# EAGLE schematic PCB-CMB-5-SHLD-3x5-1208 (EAGLE 6.5.0)

## Sheet 1 of 2
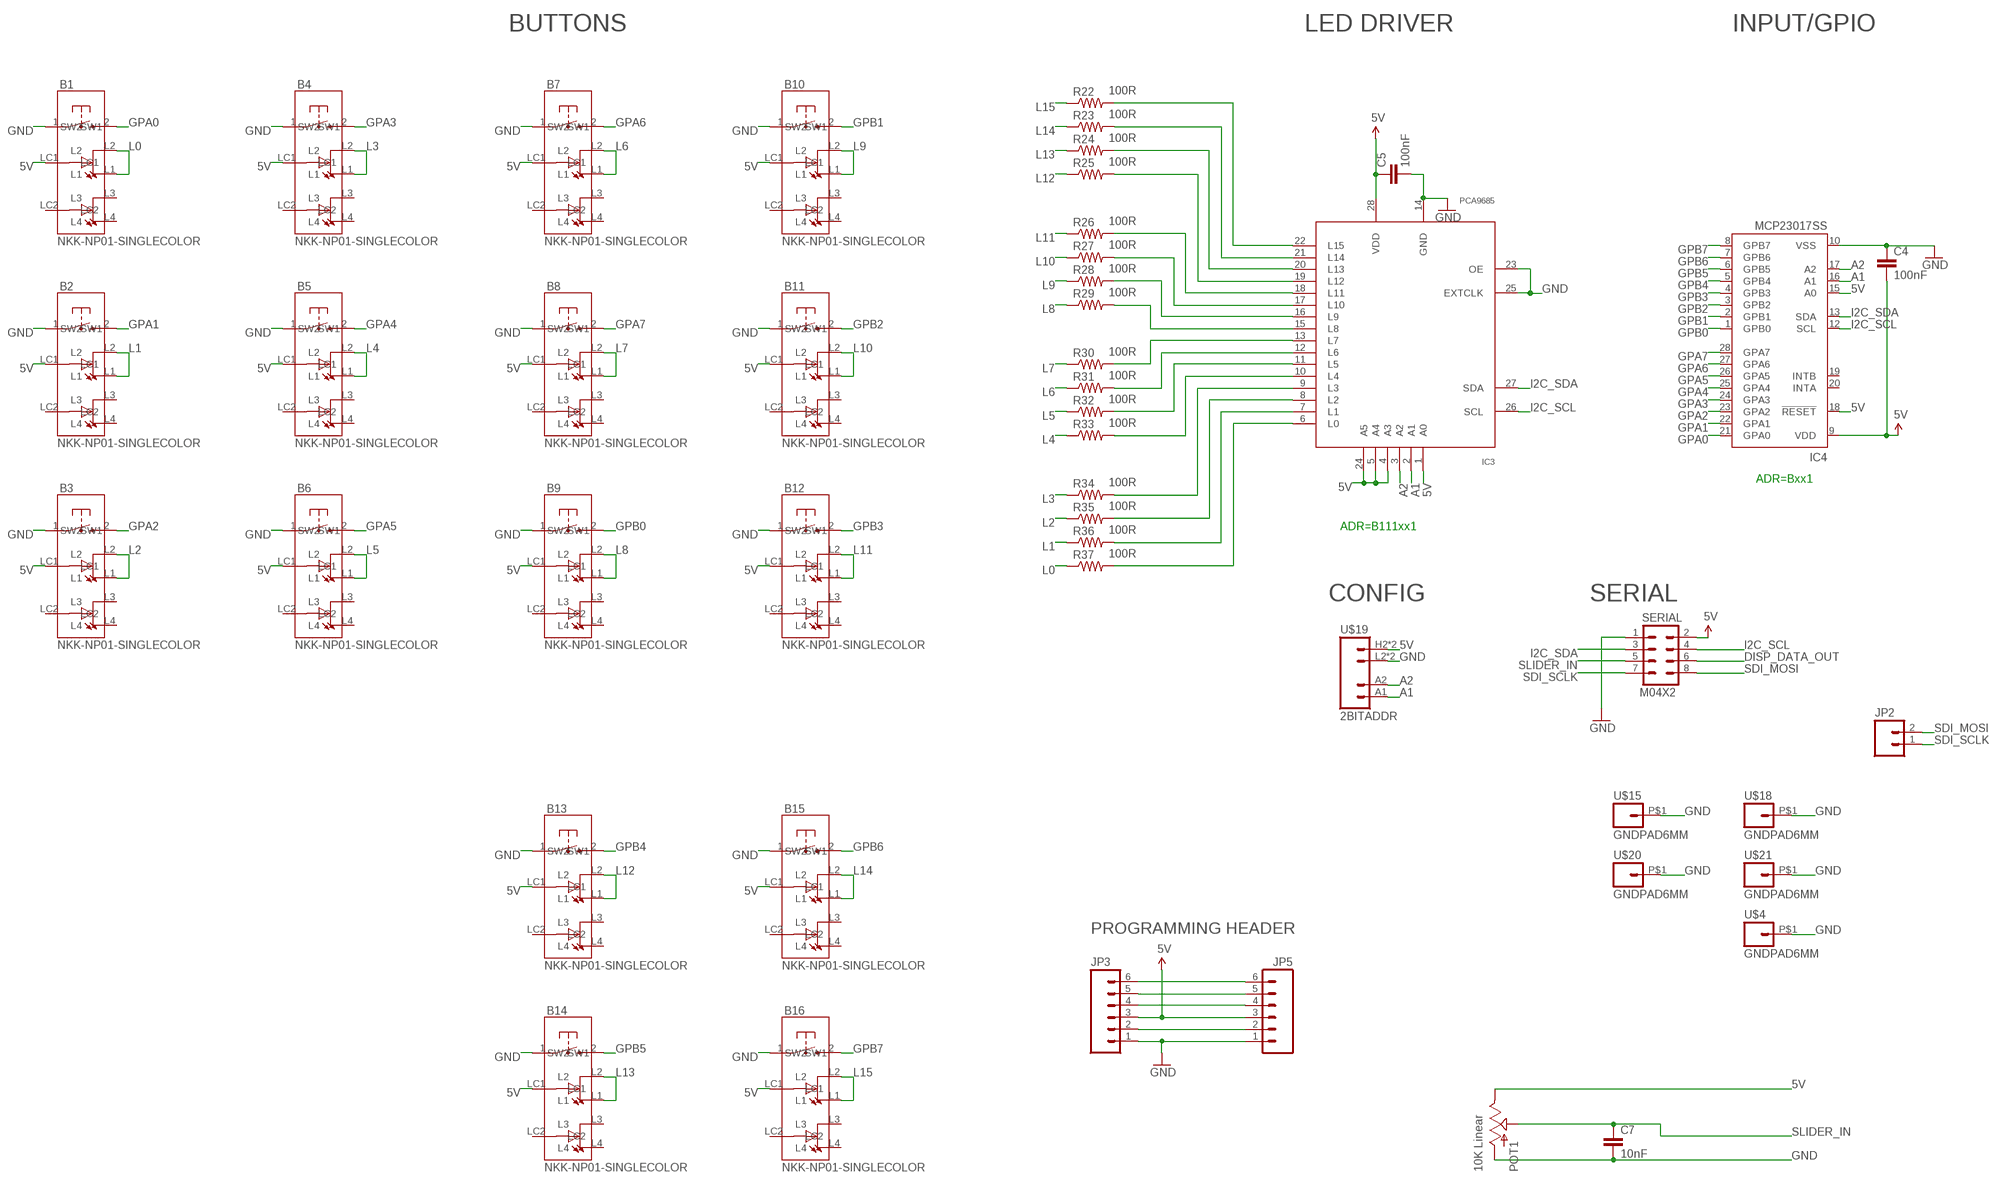
[diagram p0: schematic, sheet 1, part 1 of 2]
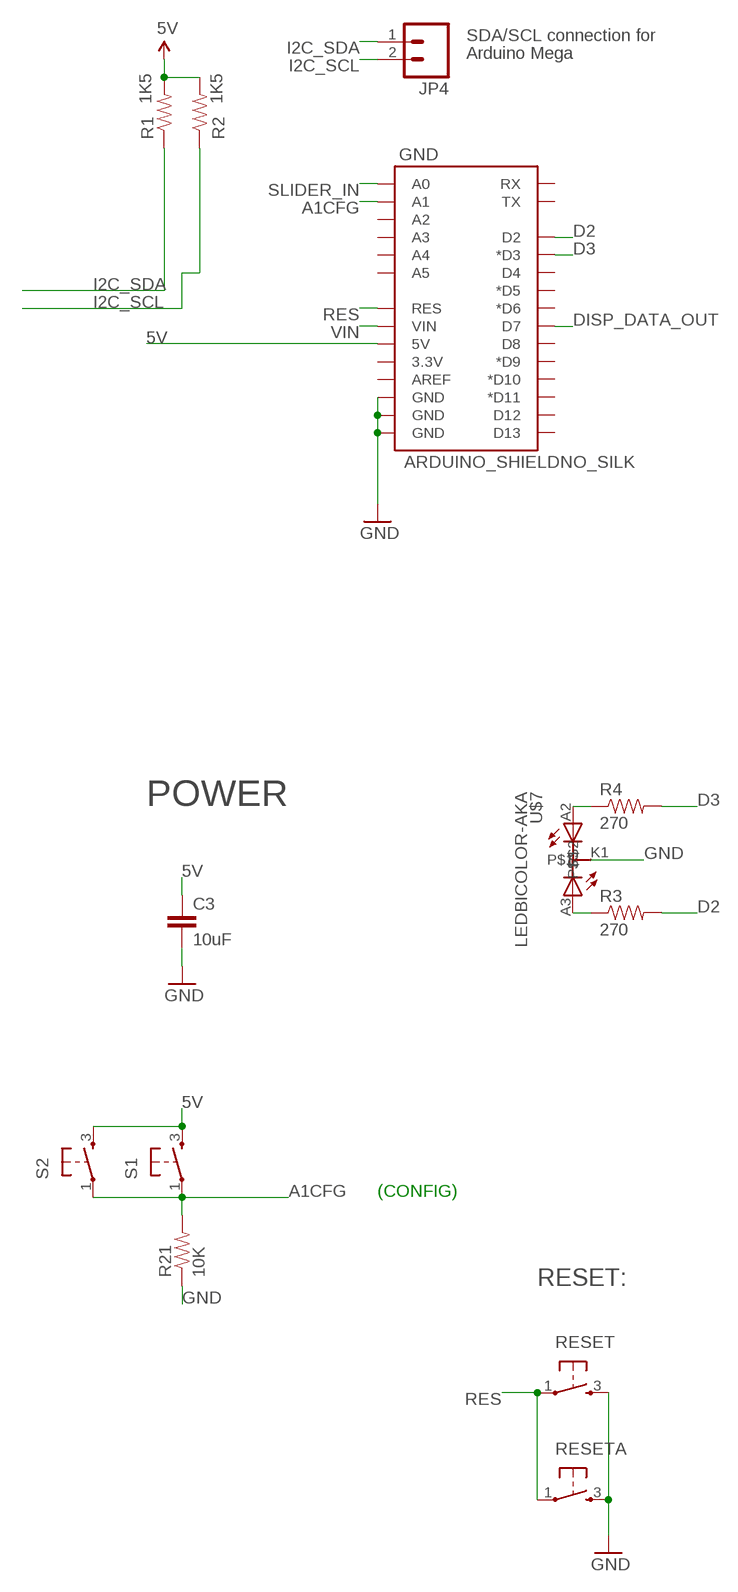
[diagram p1: schematic, sheet 1, part 2 of 2]

### Parts
B1  NKK-NP01-SINGLECOLOR  [NKK-NP01]
B2  NKK-NP01-SINGLECOLOR  [NKK-NP01]
B3  NKK-NP01-SINGLECOLOR  [NKK-NP01]
B4  NKK-NP01-SINGLECOLOR  [NKK-NP01]
B5  NKK-NP01-SINGLECOLOR  [NKK-NP01]
B6  NKK-NP01-SINGLECOLOR  [NKK-NP01]
B7  NKK-NP01-SINGLECOLOR  [NKK-NP01]
B8  NKK-NP01-SINGLECOLOR  [NKK-NP01]
B9  NKK-NP01-SINGLECOLOR  [NKK-NP01]
B10  NKK-NP01-SINGLECOLOR  [NKK-NP01]
B11  NKK-NP01-SINGLECOLOR  [NKK-NP01]
B12  NKK-NP01-SINGLECOLOR  [NKK-NP01]
B13  NKK-NP01-SINGLECOLOR  [NKK-NP01]
B14  NKK-NP01-SINGLECOLOR  [NKK-NP01]
B15  NKK-NP01-SINGLECOLOR  [NKK-NP01]
B16  NKK-NP01-SINGLECOLOR  [NKK-NP01]
C3  10uF  CAP0805  [0805]
C4  100nF  CAP0603-CAP  [0603-CAP]
C5  100nF  CAP0603-CAP  [0603-CAP]
C7  10nF  CAP0603-CAP  [0603-CAP]
GND  ARDUINO_SHIELDNO_SILK  [DUEMILANOVE_VIAS]
IC3  PCA9685  [TSSOP28]
IC4  MCP23017SS  [SSOP28]
JP2  M02PTH  [1X02]
JP3  M06POLAR  [MOLEX-1X6]
JP4  M02PTH  [1X02]
JP5  M06POLAR  [MOLEX-1X6]
POT1  10K Linear  SLIDER20  [SLIDER20]
R1  1K5  RESISTOR0603-RES  [0603-RES]
R2  1K5  RESISTOR0603-RES  [0603-RES]
R3  270  RESISTOR0603-RES  [0603-RES]
R4  270  RESISTOR0603-RES  [0603-RES]
R21  10K  RESISTOR0603-RES  [0603-RES]
R22  100R  RESISTOR1206  [1206]
R23  100R  RESISTOR1206  [1206]
R24  100R  RESISTOR1206  [1206]
R25  100R  RESISTOR1206  [1206]
R26  100R  RESISTOR1206  [1206]
R27  100R  RESISTOR1206  [1206]
R28  100R  RESISTOR1206  [1206]
R29  100R  RESISTOR1206  [1206]
R30  100R  RESISTOR1206  [1206]
R31  100R  RESISTOR1206  [1206]
R32  100R  RESISTOR1206  [1206]
R33  100R  RESISTOR1206  [1206]
R34  100R  RESISTOR1206  [1206]
R35  100R  RESISTOR1206  [1206]
R36  100R  RESISTOR1206  [1206]
R37  100R  RESISTOR1206  [1206]
RESET  TAC_SWITCH  [PUSHBUTTON]
RESETA  TAC_SWITCH  [PUSHBUTTON]
S1  TAC_SWITCH  [PUSHBUTTON]
S2  TAC_SWITCH  [PUSHBUTTON]
SERIAL  M04X2  [2X4]
U$4  GNDPAD6MM  [3.2MMPAD6MM]
U$7  LEDBICOLOR-AKA  [LED5MM-BICOLOR]
U$15  GNDPAD6MM  [3.2MMPAD6MM]
U$18  GNDPAD6MM  [3.2MMPAD6MM]
U$19  2BITADDR  [2BITADDR]
U$20  GNDPAD6MM  [3.2MMPAD6MM]
U$21  GNDPAD6MM  [3.2MMPAD6MM]

### Nets
5V [PWR]: B1.LC1 B2.LC1 B3.LC1 B4.LC1 B5.LC1 B6.LC1 B7.LC1 B8.LC1 B9.LC1 B10.LC1 B11.LC1 B12.LC1 B13.LC1 B14.LC1 B15.LC1 B16.LC1 C3.1 C4.2 C5.1 GND.5V IC3.1(A0) IC3.4(A3) IC3.5(A4) IC3.24(A5) IC3.28(VDD) IC4.9(VDD) IC4.15(A0) IC4.18(!RESET) JP3.3 JP5.3 POT1.1(E) R1.2 R2.2 S1.3 S2.3 SERIAL.2 U$19.H2(VCC) U$19.H3(VCC)
A1: IC3.2(A1) IC4.16(A1) U$19.A1
A1CFG: GND.A1 R21.2 S1.1 S2.1
A2: IC3.3(A2) IC4.17(A2) U$19.A2
D2: GND.D2 R3.2
D3: GND.D3(*D3) R4.2
DISP_DATA_OUT: GND.D7 SERIAL.6
GND [PWR]: B1.1(SW1) B2.1(SW1) B3.1(SW1) B4.1(SW1) B5.1(SW1) B6.1(SW1) B7.1(SW1) B8.1(SW1) B9.1(SW1) B10.1(SW1) B11.1(SW1) B12.1(SW1) B13.1(SW1) B14.1(SW1) B15.1(SW1) B16.1(SW1) C3.2 C4.1 C5.2 C7.2 GND.GND@0(GND) GND.GND@1(GND) GND.GND@2(GND) IC3.14(GND) IC3.23(OE) IC3.25(EXTCLK) IC4.10(VSS) JP3.1 JP5.1 POT1.3(A) R21.1 RESET.3 RESETA.3 SERIAL.1 U$4.P$1 U$7.K1 U$15.P$1 U$18.P$1 U$19.L2(GND) U$19.L3(GND) U$20.P$1 U$21.P$1
GPA0: B1.2(SW2) IC4.21(GPA0)
GPA1: B2.2(SW2) IC4.22(GPA1)
GPA2: B3.2(SW2) IC4.23(GPA2)
GPA3: B4.2(SW2) IC4.24(GPA3)
GPA4: B5.2(SW2) IC4.25(GPA4)
GPA5: B6.2(SW2) IC4.26(GPA5)
GPA6: B7.2(SW2) IC4.27(GPA6)
GPA7: B8.2(SW2) IC4.28(GPA7)
GPB0 [PWR]: B9.2(SW2) IC4.1(GPB0)
GPB1: B10.2(SW2) IC4.2(GPB1)
GPB2: B11.2(SW2) IC4.3(GPB2)
GPB3: B12.2(SW2) IC4.4(GPB3)
GPB4: B13.2(SW2) IC4.5(GPB4)
GPB5: B14.2(SW2) IC4.6(GPB5)
GPB6: B15.2(SW2) IC4.7(GPB6)
GPB7: B16.2(SW2) IC4.8(GPB7)
I2C_SCL: IC3.26(SCL) IC4.12(SCL) JP4.2 R2.1 SERIAL.4
I2C_SDA: IC3.27(SDA) IC4.13(SDA) JP4.1 R1.1 SERIAL.3
L0: B1.L1 B1.L2 R37.1
L1: B2.L1 B2.L2 R36.1
L2: B3.L1 B3.L2 R35.1
L3: B4.L1 B4.L2 R34.1
L4: B5.L1 B5.L2 R33.1
L5: B6.L1 B6.L2 R32.1
L6: B7.L1 B7.L2 R31.1
L7: B8.L1 B8.L2 R30.1
L8: B9.L1 B9.L2 R29.1
L9: B10.L1 B10.L2 R28.1
L10: B11.L1 B11.L2 R27.1
L11: B12.L1 B12.L2 R26.1
L12: B13.L1 B13.L2 R25.1
L13: B14.L1 B14.L2 R24.1
L14: B15.L1 B15.L2 R23.1
L15: B16.L1 B16.L2 R22.1
N$2: IC3.13(L7) R30.2
N$3: JP3.4 JP5.4
N$7: R4.1 U$7.A2
N$8: JP3.5 JP5.5
N$11: R3.1 U$7.A3
N$12: JP3.2 JP5.2
N$19: IC3.12(L6) R31.2
N$23: IC3.11(L5) R32.2
N$31: IC3.10(L4) R33.2
N$45: JP3.6 JP5.6
N$58: IC3.9(L3) R34.2
N$59: IC3.8(L2) R35.2
N$67: IC3.7(L1) R36.2
N$74: IC3.6(L0) R37.2
N$75: IC3.15(L8) R29.2
N$76: IC3.16(L9) R28.2
N$77: IC3.17(L10) R27.2
N$78: IC3.18(L11) R26.2
N$79: IC3.19(L12) R25.2
N$80: IC3.20(L13) R24.2
N$81: IC3.21(L14) R23.2
N$82: IC3.22(L15) R22.2
RES: GND.RES RESET.1 RESETA.1
SDI_MOSI: JP2.2 SERIAL.8
SDI_SCLK: JP2.1 SERIAL.7
SLIDER_IN: C7.1 GND.A0 POT1.2A(S) SERIAL.5
VIN: GND.VIN
Unconnected: B1.L3 B1.L4 B1.LC2 B2.L3 B2.L4 B2.LC2 B3.L3 B3.L4 B3.LC2 B4.L3 B4.L4 B4.LC2 B5.L3 B5.L4 B5.LC2 B6.L3 B6.L4 B6.LC2 B7.L3 B7.L4 B7.LC2 B8.L3 B8.L4 B8.LC2 B9.L3 B9.L4 B9.LC2 B10.L3 B10.L4 B10.LC2 B11.L3 B11.L4 B11.LC2 B12.L3 B12.L4 B12.LC2 B13.L3 B13.L4 B13.LC2 B14.L3 B14.L4 B14.LC2 B15.L3 B15.L4 B15.LC2 B16.L3 B16.L4 B16.LC2 GND.3.3V GND.A2 GND.A3 GND.A4 GND.A5 GND.AREF GND.D4 GND.D5(*D5) GND.D6(*D6) GND.D8 GND.D9(*D9) GND.D10(*D10) GND.D11(*D11) GND.D12 GND.D13 GND.RX GND.TX IC4.19(INTB) IC4.20(INTA)

### Notes on the sheet
- BUTTONS | LED DRIVER | INPUT/GPIO
- ADR=Bxx1
- ADR=B111xx1
- CONFIG | SERIAL
- PROGRAMMING HEADER
- SDA/SCL connection for
- Arduino Mega
- POWER
- (CONFIG)
- RESET:

## Sheet 2 of 2

## Library data of the parts
B1-B16 = SKAARHOJ:NKK-NP01-SINGLECOLOR
C3-C5 C7 = SparkFun:CAP: Capacitor Standard 0603 ceramic capacitor, and 0.1" leaded capacitor.
GND = SparkFun:ARDUINO_SHIELD
IC3 = wsmith:PCA9685
IC4 = microchip:MCP23017: http://ww1.microchip.com/downloads/en/DeviceDoc/21952a.pdf Source: http://ww1.microchip.com/downloads/en/DeviceDoc/21952a.pdf; MF: MICROCHIP; MPN: MCP23017-E/SS; OC_FARNELL: 1467674; OC_NEWARK: 31K2960
JP2 JP4 = SparkFun:M02: Header 2 Standard 2-pin 0.1" header. Use with straight break away headers (SKU : PRT-00116), right angle break away headers (PRT-00553), swiss pins (PRT-00743), machine pins (PRT-00117), and female headers (PRT-00115). Molex polarized connector foot print use with SKU : PRT-08233 with associated crimp pins and housings.
JP3 JP5 = SparkFun:M06: Header 6 Standard 6-pin 0.1" header. Use with straight break away headers (SKU : PRT-00116), right angle break away headers (PRT-00553), swiss pins (PRT-00743), machine pins (PRT-00117), and female headers (PRT-00115). Molex polarized connector foot print use with SKU : PRT-08094 with associated crimp pins and housings. NOTES ON THE VARIANTS LOCK and LOCK_LONGPADS... This footprint was designed to help hold the alignment of a through-hole component (i.e. 6-pin header) while soldering it into place. You may notice that each hole has been shifted either up or down by 0.005 of an inch from it's more standard position (which is a perfectly straight line). This slight alteration caused the pins (the squares in the middle) to touch the edges of the holes. Because they are alternating, it causes a "brace" to hold the component in place. 0.005 has proven to be the perfect amount of "off-center" position when using our standard breakaway headers. Although looks a little odd when you look at the bare footprint, once you have a header in there, the alteration is very hard to notice. Also, if you push a header all the way into place, it is covered up entirely on the bottom side. This idea of altering the position of holes to aid alignment will be further integrated into the Sparkfun Library for other footprints. It can help hold any component with 3 or more connection pins.
POT1 = SKAARHOJ:SLIDER
R1-R4 R21-R37 = SparkFun:RESISTOR: Resistor Basic schematic elements and footprints for 0603, 1206, and PTH resistors.
RESET RESETA S1 S2 = SKAARHOJ:TAC_SWITCH: Momentary Switch Button commonly used for reset or general input. Spark Fun Electronics SKU : COM-00097
SERIAL = SparkFun:M04X2
U$4 U$15 U$18 U$20 U$21 = SKAARHOJ:GNDPAD
U$7 = SKAARHOJ:LEDBICOLOR-AKA
U$19 = SKAARHOJ:2BITADDR

## Net classes
0 default: width 0.203 mm, drill 0.406 mm, clearance 0.203 mm
1 PWR: width 0.406 mm, drill 0.61 mm, clearance 0.203 mm
2 RELAY LINES: width 0.305 mm, clearance 0.203 mm
3 INput lines: clearance 0.203 mm